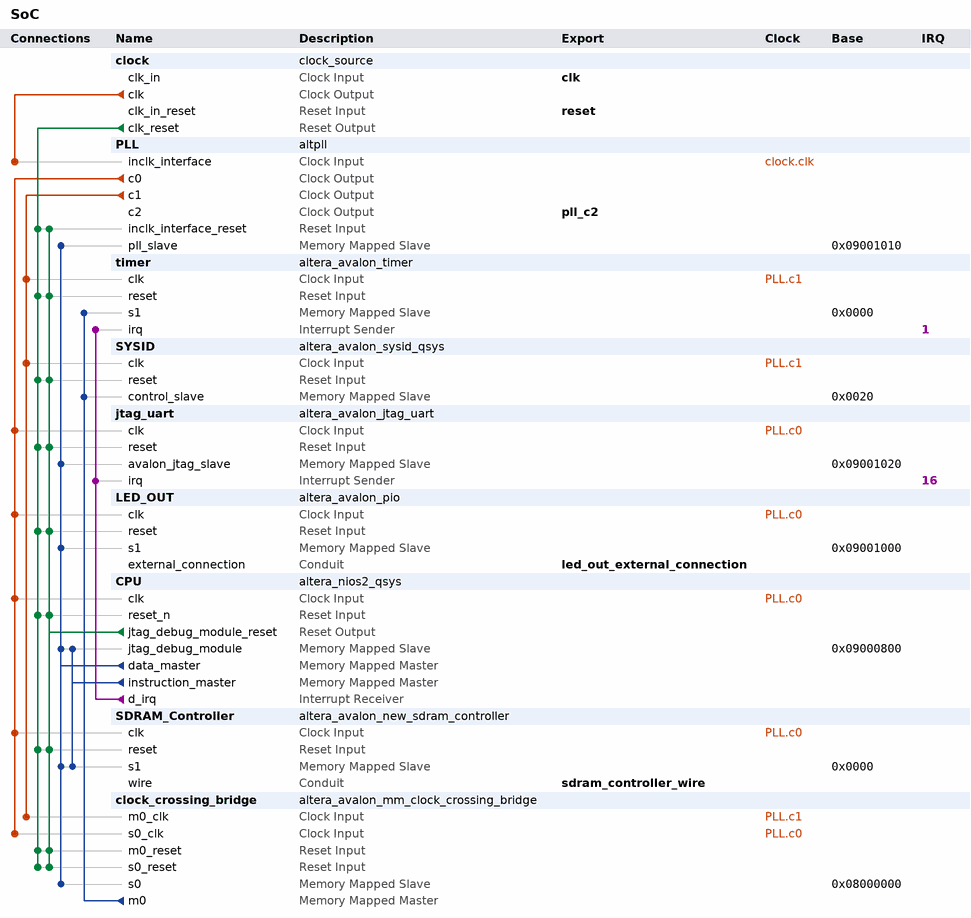
[diagram p0: system contents]
# Platform Designer (Qsys) system SoC, Cyclone IV E EP4CE115F29C7
# Parameters at their usual value, and those the tool derives, are not listed.
package require -exact qsys 13.1
create_system SoC
set_project_property DEVICE_FAMILY {Cyclone IV E}
set_project_property DEVICE EP4CE115F29C7

add_instance clock clock_source 13.1
set_instance_parameter_value clock clockFrequency 50000000

add_instance PLL altpll 13.1
set_instance_parameter_value PLL INCLK0_INPUT_FREQUENCY 10000
set_instance_parameter_value PLL CLK0_MULTIPLY_BY 1
set_instance_parameter_value PLL CLK1_MULTIPLY_BY 1
set_instance_parameter_value PLL CLK2_MULTIPLY_BY 1
set_instance_parameter_value PLL CLK0_DIVIDE_BY 1
set_instance_parameter_value PLL CLK1_DIVIDE_BY 10
set_instance_parameter_value PLL CLK2_DIVIDE_BY 1
set_instance_parameter_value PLL CLK1_PHASE_SHIFT 0
set_instance_parameter_value PLL CLK2_PHASE_SHIFT -1806
set_instance_parameter_value PLL CLK1_DUTY_CYCLE 50
set_instance_parameter_value PLL CLK2_DUTY_CYCLE 50
set_instance_parameter_value PLL PORT_clk1 PORT_USED
set_instance_parameter_value PLL PORT_clk2 PORT_USED
set_instance_parameter_value PLL PORT_clk3 PORT_UNUSED
set_instance_parameter_value PLL PORT_ARESET PORT_UNUSED
set_instance_parameter_value PLL PORT_LOCKED PORT_UNUSED

add_instance timer altera_avalon_timer 13.1
set_instance_parameter_value timer period 1
set_instance_parameter_value timer periodUnits MSEC

add_instance SYSID altera_avalon_sysid_qsys 13.1
set_instance_parameter_value SYSID id 0

add_instance jtag_uart altera_avalon_jtag_uart 13.1
set_instance_parameter_value jtag_uart simInteractiveOptions NO_INTERACTIVE_WINDOWS

add_instance LED_OUT altera_avalon_pio 13.1
set_instance_parameter_value LED_OUT direction Output
set_instance_parameter_value LED_OUT width 3

add_instance CPU altera_nios2_qsys 13.1
set_instance_parameter_value CPU resetSlave SDRAM_Controller.s1
set_instance_parameter_value CPU mmu_TLBMissExcSlave None
set_instance_parameter_value CPU exceptionSlave SDRAM_Controller.s1
set_instance_parameter_value CPU breakSlave CPU.jtag_debug_module
set_instance_parameter_value CPU muldiv_multiplierType NoneSmall
set_instance_parameter_value CPU impl Small
set_instance_parameter_value CPU icache_size 4096

add_instance SDRAM_Controller altera_avalon_new_sdram_controller 13.1
set_instance_parameter_value SDRAM_Controller TAC 6.0
set_instance_parameter_value SDRAM_Controller TRCD 20.0
set_instance_parameter_value SDRAM_Controller TRP 20.0
set_instance_parameter_value SDRAM_Controller casLatency 3
set_instance_parameter_value SDRAM_Controller columnWidth 10
set_instance_parameter_value SDRAM_Controller dataWidth 32
set_instance_parameter_value SDRAM_Controller generateSimulationModel false
set_instance_parameter_value SDRAM_Controller model single_Micron_MT48LC4M32B2_7_chip
set_instance_parameter_value SDRAM_Controller numberOfBanks 4
set_instance_parameter_value SDRAM_Controller numberOfChipSelects 1
set_instance_parameter_value SDRAM_Controller powerUpDelay 100.0
set_instance_parameter_value SDRAM_Controller refreshPeriod 15.625
set_instance_parameter_value SDRAM_Controller rowWidth 13

add_instance clock_crossing_bridge altera_avalon_mm_clock_crossing_bridge 13.1
set_instance_parameter_value clock_crossing_bridge DATA_WIDTH 32
set_instance_parameter_value clock_crossing_bridge ADDRESS_WIDTH 10
set_instance_parameter_value clock_crossing_bridge MAX_BURST_SIZE 1
set_instance_parameter_value clock_crossing_bridge COMMAND_FIFO_DEPTH 4
set_instance_parameter_value clock_crossing_bridge RESPONSE_FIFO_DEPTH 4
set_instance_parameter_value clock_crossing_bridge MASTER_SYNC_DEPTH 2
set_instance_parameter_value clock_crossing_bridge SLAVE_SYNC_DEPTH 2

# connections
add_connection clock.clk PLL.inclk_interface clock
add_connection PLL.c0 clock_crossing_bridge.s0_clk clock
add_connection PLL.c0 CPU.clk clock
add_connection PLL.c0 jtag_uart.clk clock
add_connection PLL.c0 LED_OUT.clk clock
add_connection PLL.c0 SDRAM_Controller.clk clock
add_connection PLL.c1 clock_crossing_bridge.m0_clk clock
add_connection PLL.c1 SYSID.clk clock
add_connection PLL.c1 timer.clk clock
add_connection clock.clk_reset clock_crossing_bridge.m0_reset reset
add_connection clock.clk_reset clock_crossing_bridge.s0_reset reset
add_connection clock.clk_reset CPU.reset_n reset
add_connection clock.clk_reset jtag_uart.reset reset
add_connection clock.clk_reset LED_OUT.reset reset
add_connection clock.clk_reset PLL.inclk_interface_reset reset
add_connection clock.clk_reset SDRAM_Controller.reset reset
add_connection clock.clk_reset SYSID.reset reset
add_connection clock.clk_reset timer.reset reset
add_connection CPU.jtag_debug_module_reset clock_crossing_bridge.m0_reset reset
add_connection CPU.jtag_debug_module_reset clock_crossing_bridge.s0_reset reset
add_connection CPU.jtag_debug_module_reset CPU.reset_n reset
add_connection CPU.jtag_debug_module_reset jtag_uart.reset reset
add_connection CPU.jtag_debug_module_reset LED_OUT.reset reset
add_connection CPU.jtag_debug_module_reset PLL.inclk_interface_reset reset
add_connection CPU.jtag_debug_module_reset SDRAM_Controller.reset reset
add_connection CPU.jtag_debug_module_reset SYSID.reset reset
add_connection CPU.jtag_debug_module_reset timer.reset reset
add_connection clock_crossing_bridge.m0 SYSID.control_slave avalon
set_connection_parameter_value clock_crossing_bridge.m0/SYSID.control_slave baseAddress 0x0020
add_connection clock_crossing_bridge.m0 timer.s1 avalon
set_connection_parameter_value clock_crossing_bridge.m0/timer.s1 baseAddress 0x0000
add_connection CPU.data_master clock_crossing_bridge.s0 avalon
set_connection_parameter_value CPU.data_master/clock_crossing_bridge.s0 baseAddress 0x08000000
add_connection CPU.data_master CPU.jtag_debug_module avalon
set_connection_parameter_value CPU.data_master/CPU.jtag_debug_module baseAddress 0x09000800
add_connection CPU.data_master jtag_uart.avalon_jtag_slave avalon
set_connection_parameter_value CPU.data_master/jtag_uart.avalon_jtag_slave baseAddress 0x09001020
add_connection CPU.data_master LED_OUT.s1 avalon
set_connection_parameter_value CPU.data_master/LED_OUT.s1 baseAddress 0x09001000
add_connection CPU.data_master PLL.pll_slave avalon
set_connection_parameter_value CPU.data_master/PLL.pll_slave baseAddress 0x09001010
add_connection CPU.data_master SDRAM_Controller.s1 avalon
set_connection_parameter_value CPU.data_master/SDRAM_Controller.s1 baseAddress 0x0000
add_connection CPU.instruction_master CPU.jtag_debug_module avalon
set_connection_parameter_value CPU.instruction_master/CPU.jtag_debug_module baseAddress 0x09000800
add_connection CPU.instruction_master SDRAM_Controller.s1 avalon
set_connection_parameter_value CPU.instruction_master/SDRAM_Controller.s1 baseAddress 0x0000
add_connection CPU.d_irq jtag_uart.irq interrupt
set_connection_parameter_value CPU.d_irq/jtag_uart.irq irqNumber 16
add_connection CPU.d_irq timer.irq interrupt
set_connection_parameter_value CPU.d_irq/timer.irq irqNumber 1

# exported interfaces
add_interface clk clock sink
set_interface_property clk EXPORT_OF clock.clk_in
add_interface reset reset sink
set_interface_property reset EXPORT_OF clock.clk_in_reset
add_interface led_out_external_connection conduit end
set_interface_property led_out_external_connection EXPORT_OF LED_OUT.external_connection
add_interface pll_c2 clock source
set_interface_property pll_c2 EXPORT_OF PLL.c2
add_interface sdram_controller_wire conduit end
set_interface_property sdram_controller_wire EXPORT_OF SDRAM_Controller.wire

set_interconnect_requirement {$system} qsys_mm.clockCrossingAdapter HANDSHAKE
set_interconnect_requirement {$system} qsys_mm.maxAdditionalLatency 1
set_interconnect_requirement {$system} qsys_mm.insertDefaultSlave false

save_system SoC.qsys
